# EAGLE design Sensor_Board (EAGLE 7.2.0)
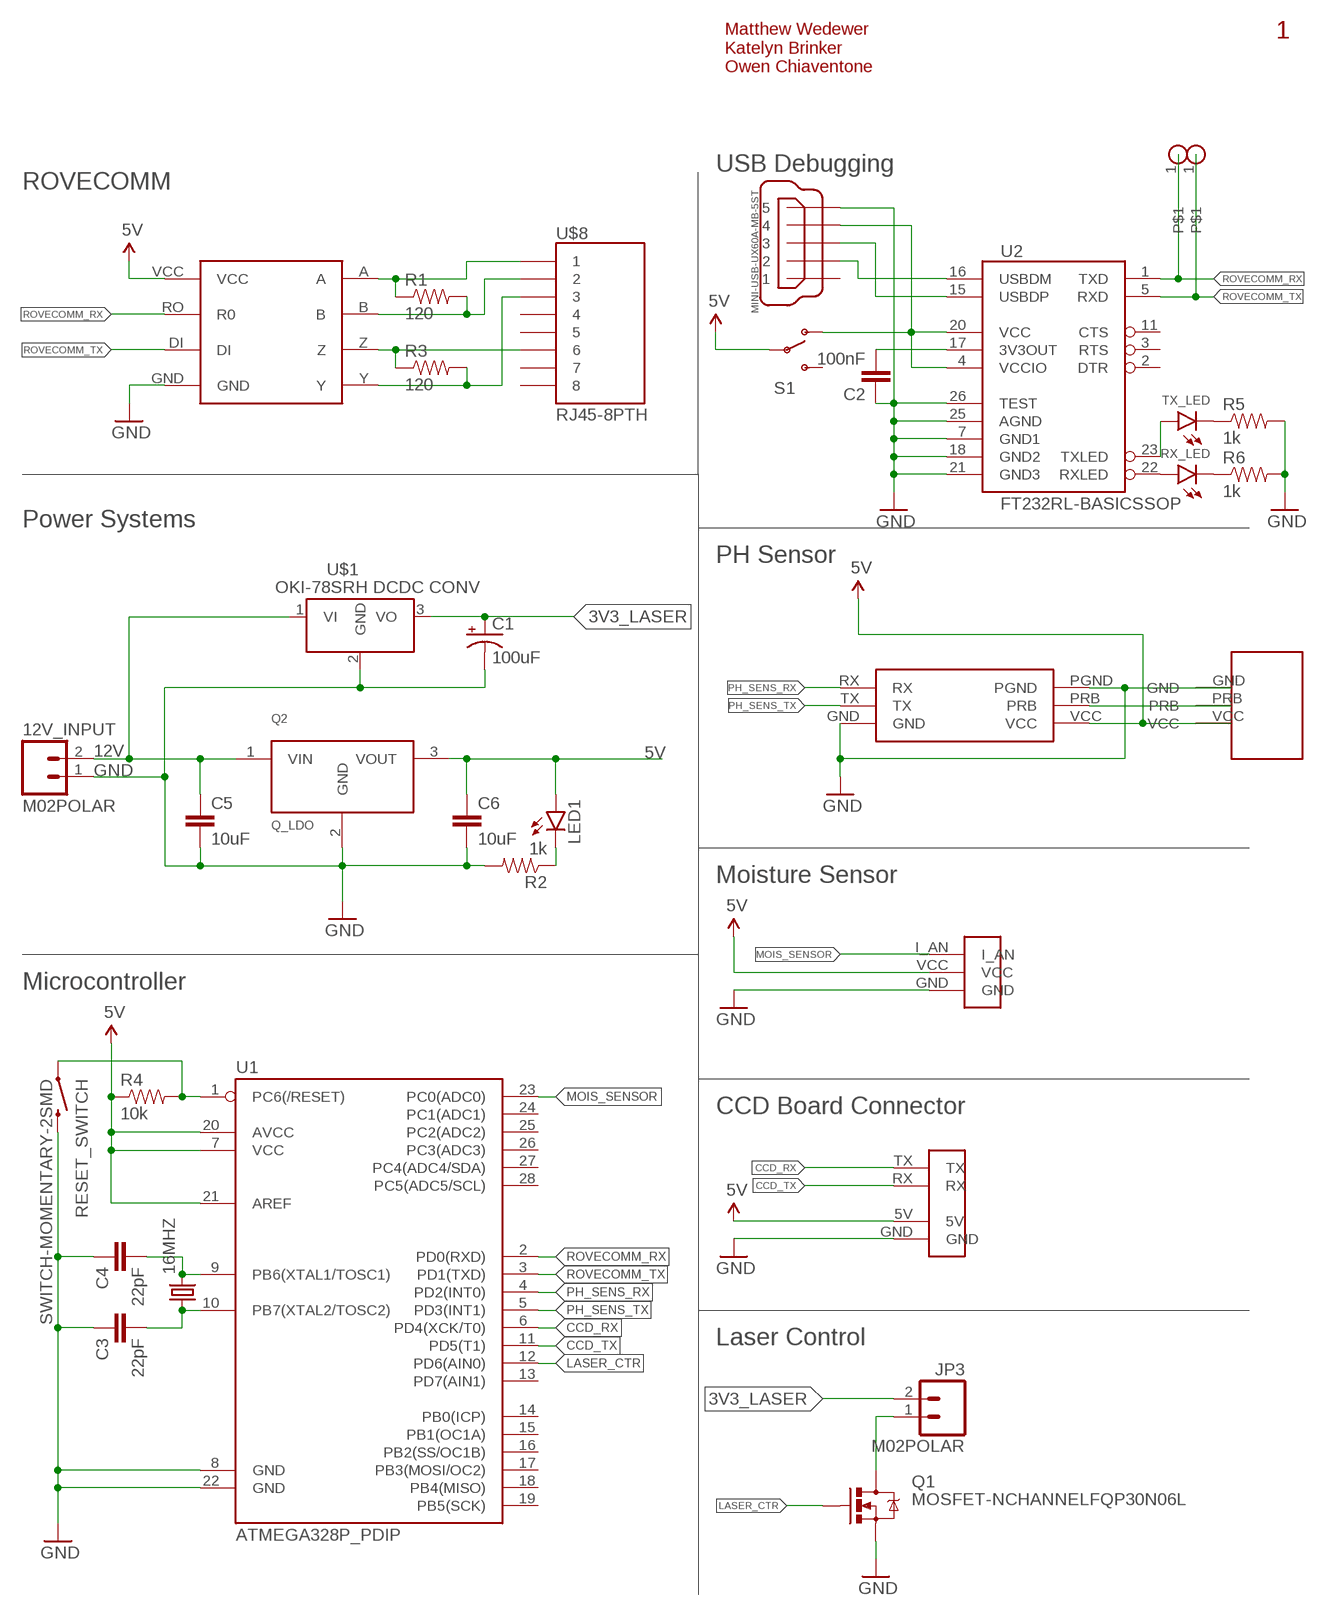
[diagram p0: schematic, sheet 1]

## Parts
12V_INPUT  M02POLAR  [MOLEX-1X2]
16MHZ  CRYSTALHC49US  [HC49US]
C1  100uF  CAP_POLPTH1  [CPOL-RADIAL-100UF-25V]
C2  100nF  CAP1206  [1206]
C3  22pF  CAP1206  [1206]
C4  22pF  CAP1206  [1206]
C5  10uF  CAP1206  [1206]
C6  10uF  CAP1206  [1206]
DEBUG_RX  J_HOLE  [J_AWG20]
DEBUG_TX  J_HOLE  [J_AWG20]
JP3  M02POLAR  [MOLEX-1X2]
LED1  LED1206  [LED-1206]
Q1  MOSFET-NCHANNELFQP30N06L  [TO220V]
Q2  Q_LDO  [TO-220]
R1  120  RESISTOR1206  [1206]
R2  1k  RESISTOR1206  [1206]
R3  120  RESISTOR1206  [1206]
R4  10k  RESISTOR1206  [1206]
R5  1k  RESISTOR1206  [1206]
R6  1k  RESISTOR1206  [1206]
RESET_SWITCH  SWITCH-MOMENTARY-2SMD  [TACTILE-SWITCH-SMD]
RX_LED  LED1206  [LED-1206]
S1  SWITCH-SPDTPTH  [SWITCH-SPDT]
TX_LED  LED1206  [LED-1206]
U1  ATMEGA328P_PDIP  [DIL28-3]
U2  FT232RL-BASICSSOP  [SSOP28DB]
U$1  Q_OKI-78SR  [OKI-78SRH]
U$3  PH_EZ0  [PH_EZ0]
U$4  PH_CONNECTOR  [PH_CONNECTOR]
U$5  MOISTURE_SENSOR  [MOISTURE_SENSOR]
U$6  CCD_CONNECTOR  [CCD_CONNECTOR]
U$7  MAX3077  [MAX3070E]
U$8  RJ45-8PTH  [RJ45-8]
X1  MINI-USB-UX60A-MB-5ST  [UX60A-MB-5ST]

## Nets
3V3_LASER: C1.1(+) JP3.2 U$1.3(VO)
5V: C6.1 LED1.A Q2.3(VOUT) R4.1 S1.2(P) U1.7(VCC) U1.20(AVCC) U1.21(AREF) U$3.VCC U$4.VCC U$5.VCC U$6.5V U$7.VCC
5V1: TX_LED.A U2.23(TXLED)
12V: 12V_INPUT.2 C5.1 Q2.1(VIN) U$1.1(VI)
CCD_RX: U1.6(PD4(XCK/T0)) U$6.TX
CCD_TX: U1.11(PD5(T1)) U$6.RX
GND: 12V_INPUT.1 C1.2(-) C2.1 C3.1 C4.1 C5.2 C6.2 Q1.3(S) Q2.2(GND) R2.2 R5.2 R6.2 RESET_SWITCH.3 U1.8(GND) U1.22(GND) U2.7(GND1) U2.18(GND2) U2.21(GND3) U2.25(AGND) U2.26(TEST) U$1.2(GND) U$3.GND U$3.PGND U$4.GND U$5.GND U$6.GND U$7.GND X1.5
LASER_CTR: Q1.1(G) U1.12(PD6(AIN0))
MOIS_SENSOR: U1.23(PC0(ADC0)) U$5.I_AN
N$1: JP3.1 Q1.2(D)
N$2: 16MHZ.2 C4.2 U1.9(PB6(XTAL1/TOSC1))
N$3: LED1.C R2.1
N$4: 16MHZ.1 C3.2 U1.10(PB7(XTAL2/TOSC2))
N$5: U$3.PRB U$4.PRB
N$6: R1.1 U$7.A U$8.1
N$7: R1.2 U$7.B U$8.2
N$8: R3.1 U$7.Z U$8.6
N$9: R3.2 U$7.Y U$8.3
N$10: R4.2 RESET_SWITCH.1 U1.1(PC6(/RESET))
N$11: C2.2 U2.17(3V3OUT)
N$12: U2.16(USBDM) X1.2
N$13: U2.15(USBDP) X1.3
N$14: S1.1(O) U2.4(VCCIO) U2.20(VCC) X1.4
N$15: R5.1 TX_LED.C
N$16: RX_LED.A U2.22(RXLED)
N$17: R6.1 RX_LED.C
PH_SENS_RX: U1.4(PD2(INT0)) U$3.RX
PH_SENS_TX: U1.5(PD3(INT1)) U$3.TX
ROVECOMM_RX: DEBUG_RX.1 U1.2(PD0(RXD)) U2.1(TXD) U$7.RO(R0)
ROVECOMM_TX: DEBUG_TX.1 U1.3(PD1(TXD)) U2.5(RXD) U$7.DI
Unconnected: S1.3(S) U1.13(PD7(AIN1)) U1.14(PB0(ICP)) U1.15(PB1(OC1A)) U1.16(PB2(SS/OC1B)) U1.17(PB3(MOSI/OC2)) U1.18(PB4(MISO)) U1.19(PB5(SCK)) U1.24(PC1(ADC1)) U1.25(PC2(ADC2)) U1.26(PC3(ADC3)) U1.27(PC4(ADC4/SDA)) U1.28(PC5(ADC5/SCL)) U2.2(DTR) U2.3(RTS) U2.11(CTS) U$8.4 U$8.5 U$8.7 U$8.8 X1.1

## Notes on the sheet
- 1
- Matthew Wedewer
  Katelyn Brinker
  Owen Chiaventone
- USB Debugging
- ROVECOMM
- Power Systems
- PH Sensor
- Moisture Sensor
- Microcontroller
- CCD Board Connector
- Laser Control

## Library data of the parts
12V_INPUT JP3 = SparkFun-Connectors:M02: Standard 2-pin 0.1" header. Use with - straight break away headers ( PRT-00116) - right angle break away headers (PRT-00553) - swiss pins (PRT-00743) - machine pins (PRT-00117) - female headers (PRT-00115) Molex polarized connector foot print use with: PRT-08233 with associated crimp pins and housings. 2.54_SCREWTERM for use with PRT-10571. 3.5mm Screw Terminal footprints for PRT-08084 5mm Screw Terminal footprints for use with PRT-08433
16MHZ = SparkFun-FreqCtrl:CRYSTAL: Various standard crystals. Proven footprints.
C1 = SparkFun-Capacitors:CAP_POL: Capacitor Polarized These are standard SMD and PTH capacitors. Normally 10uF, 47uF, and 100uF in electrolytic and tantalum varieties. Always verify the external diameter of the through hole cap, it varies with capacity, voltage, and manufacturer. The EIA devices should be standard.
C2-C4 = SparkFun-Passives:CAP: Capacitor Standard 0603 ceramic capacitor, and 0.1" leaded capacitor.
C5 C6 = SparkFun-Capacitors:CAP: Capacitor Standard 0603 ceramic capacitor, and 0.1" leaded capacitor.
DEBUG_RX DEBUG_TX = MRDT-2015-General:J_HOLE: Mounting hole for AWG #20
LED1 RX_LED TX_LED = SparkFun-LED:LED: LEDs Standard schematic elements and footprints for 5mm, 3mm, 1206, and 0603 sized LEDs. 5mm - Spark Fun Electronics SKU : COM-00529 (and others)
Q1 = SparkFun-DiscreteSemi:MOSFET-NCHANNEL: Common NMOSFET Parts MFG P/N Store ID Prod ID FDD8780 TRANS-09984 SI7820DN TRANS-11055 FDS6630A IC-08089 2N7002PW TRANS-11151 FQP30N06L COM-10213 TRANS-10060 BSS123LT1G TRANS-08345 BSS138 TRANS-00830 BS170 2N7000; PROD_ID: TRANS-10060
Q2 = MRDT-2015-General:Q_LDO: LDO with fixed ouput voltage
R1-R6 = SparkFun-Passives:RESISTOR: Resistor Basic schematic elements and footprints for 0603, 1206, and PTH resistors.
RESET_SWITCH = SparkFun-Electromechanical:SWITCH-MOMENTARY-2: Various NO switches- pushbuttons, reed, etc; PROD_ID: SWCH-08247
S1 = SparkFun-Electromechanical:SWITCH-SPDT: SPDT Switch Simple slide switch, Spark Fun Electronics SKU : COM-00102 DPDT SMT slide switch, AYZ0202, SWCH-08179
U1 = SparkFun-DigitalIC:ATMEGA328P_PDIP: uC used in the Arduino 32kb flash, 1k EEPROM, 2k SRAM This is the through-hole version of this chip.
U2 = SparkFun-DigitalIC:FT232RL-BASIC: USB UART This is the simplified version of the FT232RL unit. Only what you need, nothing you don't. Spark Fun Electronics SKU : COM-00650
U$1 = MRDT-2015-PowerBoard:Q_OKI-78SR: 4.95W DC/DC Converter Manufacturer: Murata Part Number: OKI-78SR-5/1.5-W36H-C OKI-78SR-3.3/1.5-W36H-C
U$3 = pH_EZ0:PH_EZ0
U$4 = PH_CONNECTOR:PH_CONNECTOR
U$5 = moisture sensor:MOISTURE_SENSOR
U$6 = CCD_CONNECTOR:CCD_CONNECTOR
U$7 = MAX3077:MAX3077
U$8 = SparkFun-Connectors:RJ45-8: RJ45 Jack Simple RJ45, 8-pin connection - connector for common Cat5, Cat5e, and Cat6 Ethernet cables. Footprint not yet proven in production. Connector sku is PRT-00643; Breakout PCB sku is BOB-00716.
X1 = con-hirose:MINI-USB-: MINI USB Connector Source: http://www.hirose.co.jp/cataloge_hp/e24000019.pdf; OC_FARNELL: unknown; OC_NEWARK: unknown

## Board
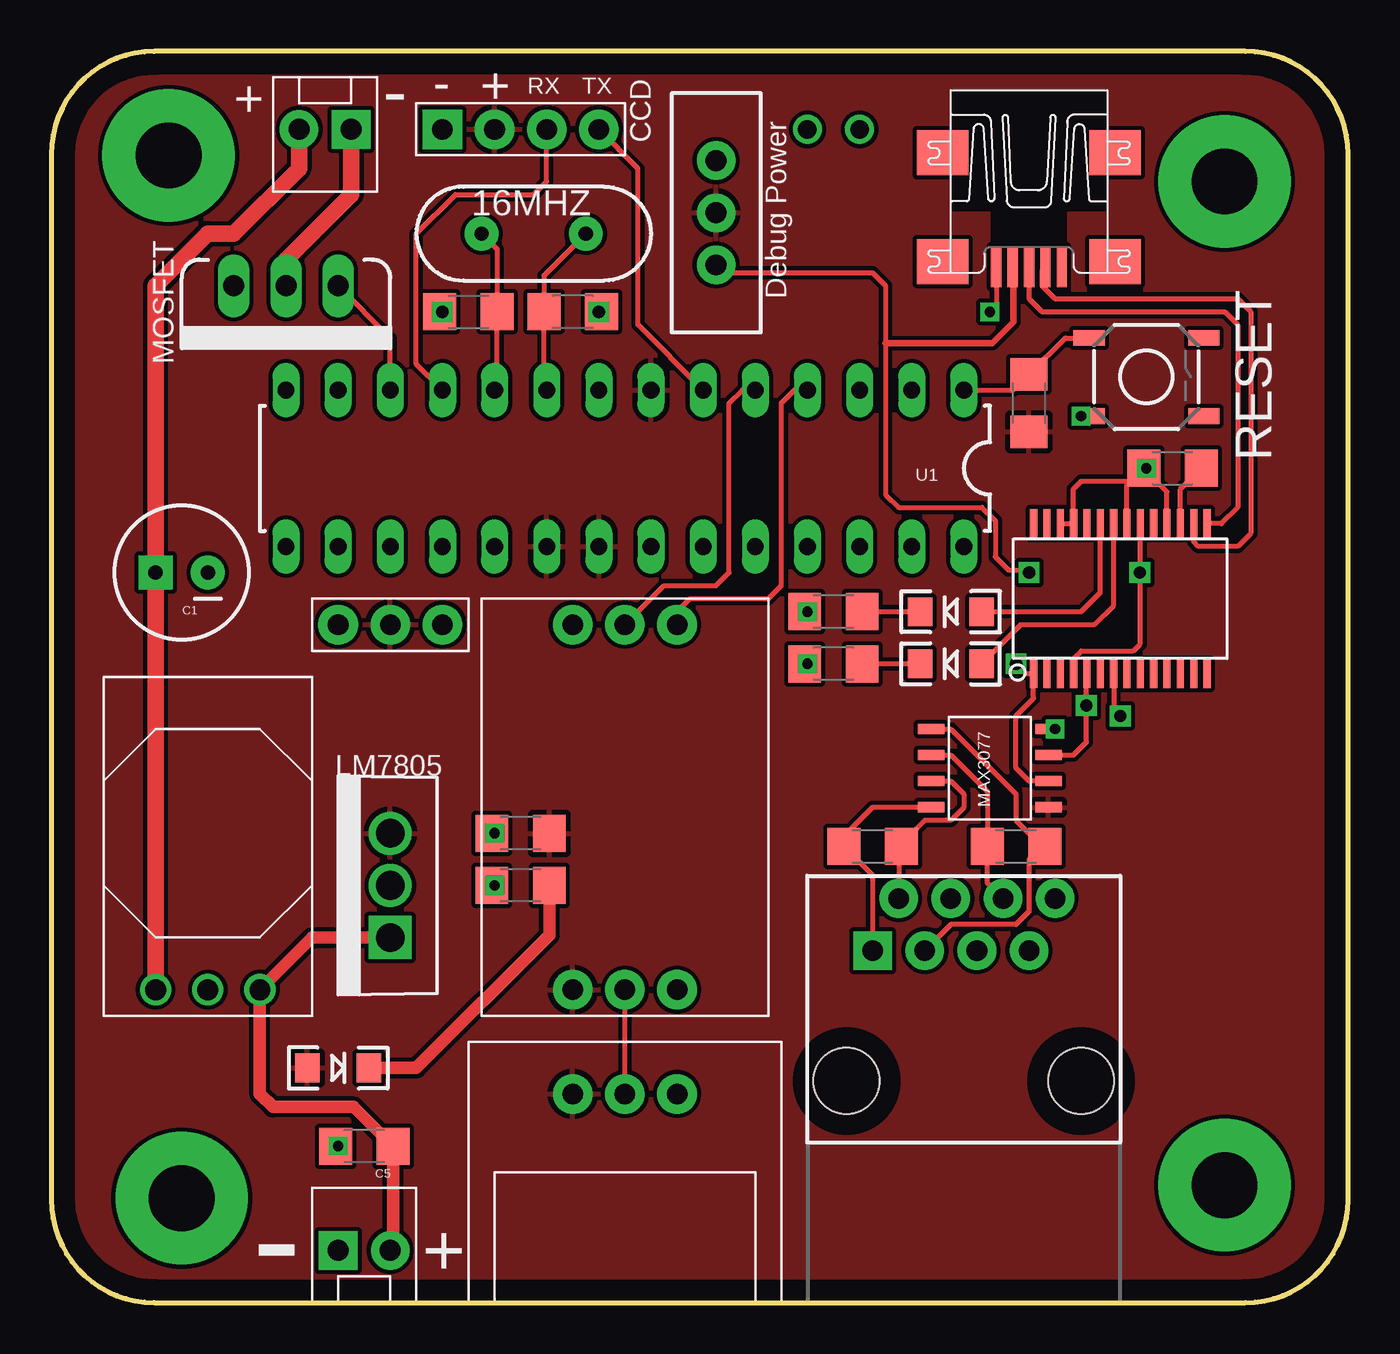
[diagram p1: board, top side]
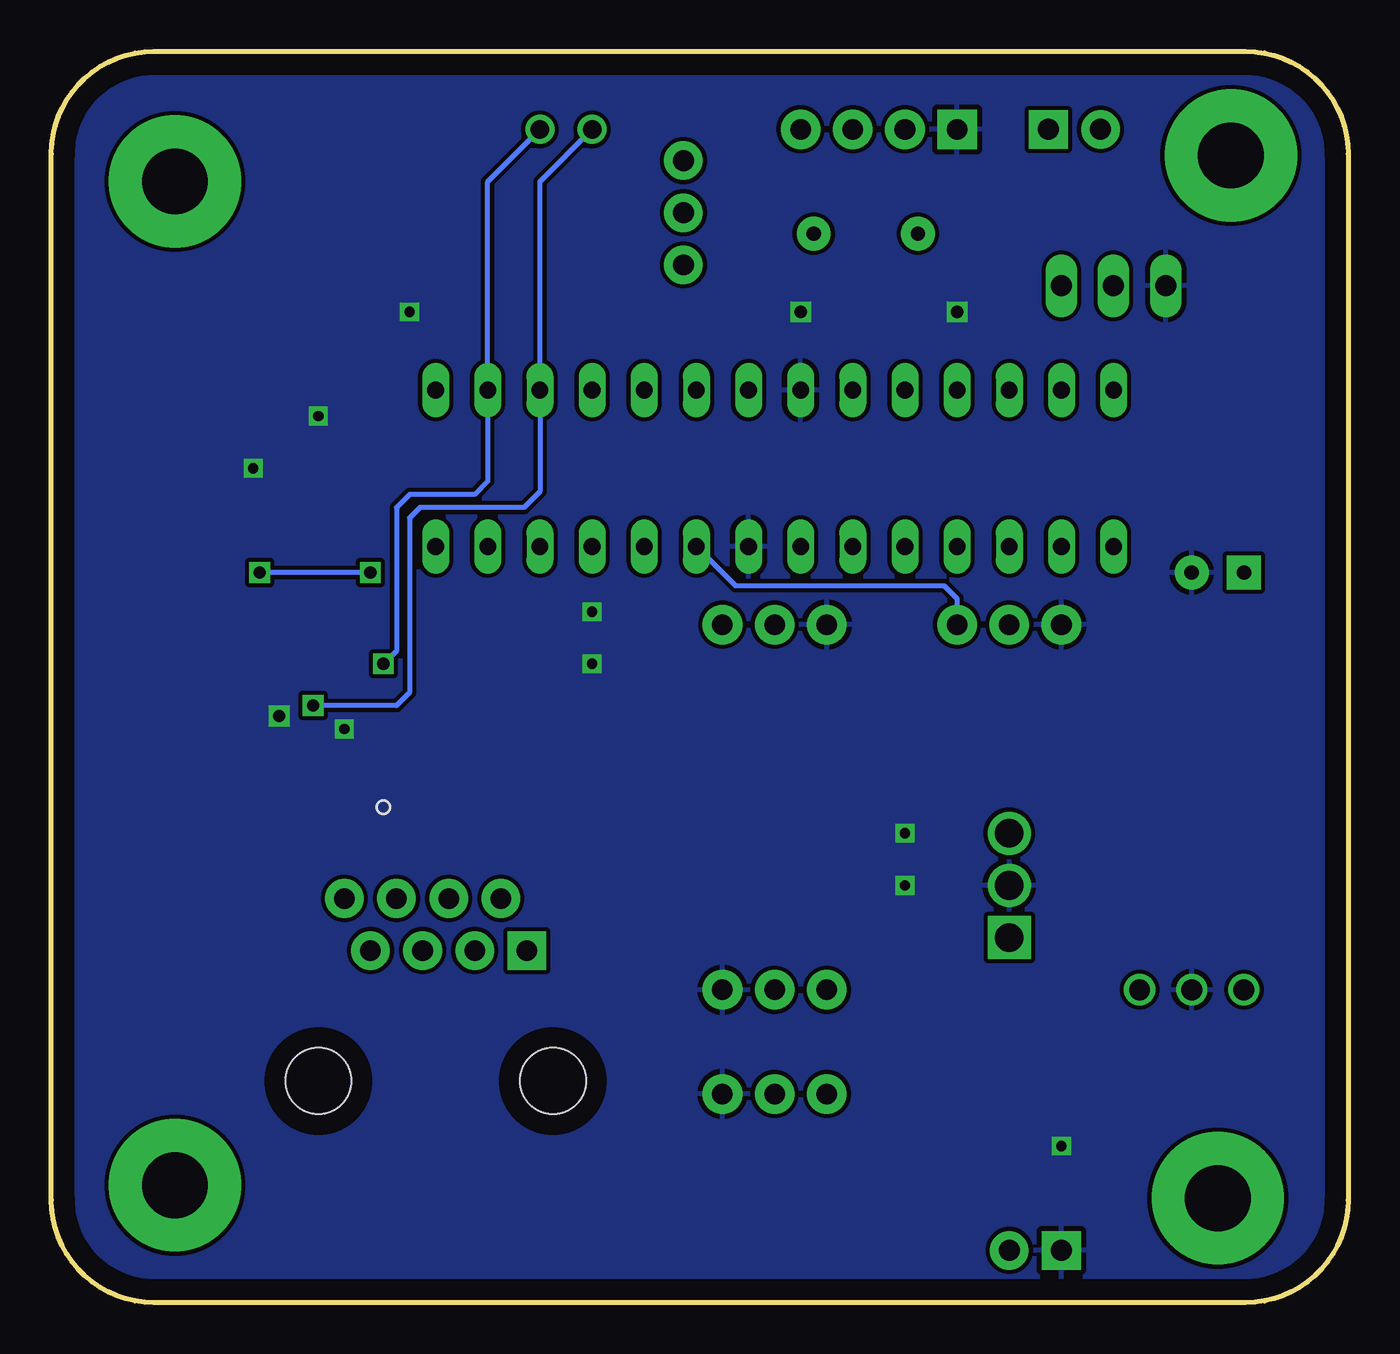
[diagram p2: board, bottom side, seen from below]

Size 63.17 x 60.95 mm. Coordinates in mm from the lower left corner, seen from the top.
Outline: 0,55.95 0,5 arc90 5,0 58.17,0 arc90 63.17,5 63.17,55.95 arc90 58.17,60.95 5,60.95 arc90 0,55.95
Copper layers (1*16): Top 0.035mm / dielectric 1.5mm / Bottom 0.035mm
Design rules "default": minimum track width 10mil, minimum drill 24mil, track to track 8mil, track to pad 8mil, pad to pad 8mil, via to via 8mil, smd to smd 8mil, copper to edge 40mil, drill to drill 8mil, minimum pad ring 10mil, minimum via ring 8mil, stop-mask expansion 4mil, vias tented up to drill 0mil, thermal gap 10mil

### Footprints (pad centres in the part's own frame; a part is rotated, then mirrored left to right if it is on the bottom)
MOLEX-1X2 = drill 1.016 pad 1.88 square: 1 0,0 | drill 1.016 pad 1.88: 2 2.54,0
HC49US = drill 0.7 pad 1.651: 1 -2.54,0; 2 2.54,0
CPOL-RADIAL-100UF-25V = drill 0.7 pad 1.651 square: 1 1.27,0 | drill 0.7 pad 1.651: 2 -1.27,0
1206 = smd 1.6 x 1.8: 1 -1.4,0; 2 1.4,0
J_AWG20 = drill 0.9: 1 0,0
LED-1206 = smd 1.2 x 1.4: A -1.5,0; C 1.5,0
TO220V = drill 1.016 long: 1 -2.54,0; 2 0,0; 3 2.54,0
TO-220 = drill 1.397 square: 1 -2.54,0 | drill 1.397: 2 0,0; 3 2.54,0
TACTILE-SWITCH-SMD = smd 1.524 x 0.762: 1 -2.794,1.905; 2 2.794,1.905; 3 -2.794,-1.905; 4 2.794,-1.905
SWITCH-SPDT = drill 1.016 pad 1.88: 1 0,2.54; 2 0,0; 3 0,-2.54
DIL28-3 = drill 0.813 long: 1 -16.51,-3.81; 2 -13.97,-3.81; 3 -11.43,-3.81; 4 -8.89,-3.81; 5 -6.35,-3.81; 6 -3.81,-3.81; 7 -1.27,-3.81; 8 1.27,-3.81; 9 3.81,-3.81; 10 6.35,-3.81; 11 8.89,-3.81; 12 11.43,-3.81; 13 13.97,-3.81; 14 16.51,-3.81; 15 16.51,3.81; 16 13.97,3.81; 17 11.43,3.81; 18 8.89,3.81; 19 6.35,3.81; 20 3.81,3.81; 21 1.27,3.81; 22 -1.27,3.81; 23 -3.81,3.81; 24 -6.35,3.81; 25 -8.89,3.81; 26 -11.43,3.81; 27 -13.97,3.81; 28 -16.51,3.81
SSOP28DB = smd 0.348 x 1.397: 1 -4.225,-3.656; 2 -3.575,-3.656; 3 -2.925,-3.656; 4 -2.275,-3.656; 5 -1.625,-3.656; 6 -0.975,-3.656; 7 -0.325,-3.656; 8 0.325,-3.656; 9 0.975,-3.656; 10 1.625,-3.656; 11 2.275,-3.656; 12 2.925,-3.656; 13 3.575,-3.656; 14 4.225,-3.656; 15 4.225,3.656; 16 3.575,3.656; 17 2.925,3.656; 18 2.275,3.656; 19 1.625,3.656; 20 0.975,3.656; 21 0.325,3.656; 22 -0.325,3.656; 23 -0.975,3.656; 24 -1.625,3.656; 25 -2.275,3.656; 26 -2.925,3.656; 27 -3.575,3.656; 28 -4.225,3.656
OKI-78SRH = drill 1.016: 1 2.54,0; 2 0,0; 3 -2.54,0
PH_EZ0 = drill 1 pad 1.93: GND 4.445,19.05; PGND 9.525,1.27; PRB 6.985,1.27; RX 9.525,19.05; TX 6.985,19.05; VCC 4.445,1.27
PH_CONNECTOR = drill 1 pad 1.93: GND 2.54,2.54; PRB 0,2.54; VCC -2.54,2.54
MOISTURE_SENSOR = drill 1 pad 1.93: GND -2.54,0; I_AN 2.54,0; VCC 0,0
CCD_CONNECTOR = drill 1 pad 1.93: 5V 1.27,0; RX -1.27,0; TX -3.81,0 | drill 1 pad 1.93 square: GND 3.81,0
MAX3070E = smd 0.49 x 1.3: A -1.905,2.857; B -0.635,2.857; DI 0.635,-2.857; GND 1.905,-2.857; RO -0.635,-2.857; VCC -1.905,-2.857; Y 1.905,2.857; Z 0.635,2.857
RJ45-8 = drill 1 pad 1.88 square: 1 -4.445,6.35 | drill 1 pad 1.88: 2 -3.175,8.89; 3 -1.905,6.35; 4 -0.635,8.89; 5 0.635,6.35; 6 1.905,8.89; 7 3.175,6.35; 8 4.445,8.89 | hole 3.2: -5.715,0; 5.715,0
UX60A-MB-5ST = smd 2 x 0.5: 1 2.25,1.6; 2 2.25,0.8; 3 2.25,0; 4 2.25,-0.8; 5 2.25,-1.6 | smd 2.2 x 2.5: M1 -3.3,-4.2; M2 -3.3,4.2; M3 2,4.2; M4 2,-4.2

### Placement (x,y rotation side)
12V_INPUT  13.97,2.54 0 top
16MHZ  23.5,52.07 0 top
C1  6.35,35.56 180 top
C2  54.61,40.64 0 top
C3  20.32,48.26 0 top
C4  25.4,48.26 180 top
C5  15.24,7.62 180 top
C6  22.86,22.86 180 top
DEBUG_RX  39.37,57.15 270 top
DEBUG_TX  36.83,57.15 270 top
JP3  14.61,57.15 180 top
LED1  13.97,11.43 0 top
Q1  11.43,49.53 180 top
Q2  16.51,20.32 90 top
R1  40.01,22.23 0 top
R2  22.86,20.32 180 top
R3  46.99,22.23 0 top
R4  47.62,43.81 90 top
R5  38.1,33.66 180 top
R6  38.1,31.11 180 top
RESET_SWITCH  53.34,45.09 0 top
RX_LED  43.81,31.11 180 top
S1  32.38,53.09 180 top
TX_LED  43.81,33.66 180 top
U1  27.94,40.64 180 top
U2  52.07,34.29 0 top
U$1  7.62,15.24 0 top
U$3  20.95,13.97 0 top
U$4  27.94,7.62 0 top
U$5  16.51,33.02 0 top
U$6  22.86,57.15 180 top
U$7  45.72,26.04 90 top
U$8  44.45,10.79 0 top
X1  47.62,52.7 270 top

### Tracks (layer width: path | path; a pad name or v marks a point on that pad's centre or on a via)
3V3_LASER
  Top 0.813: U$1.3 C1.1 5.08,49.53 7.62,52.07 8.89,52.07 12.06,55.24 JP3.2
5V
  pour Top: -1.27,62.23 63.5,62.23 63.5,-1.27 -1.27,-1.27
5V1
  Top 0.254: TX_LED.A 50.16,33.66 51.09,34.59 U2.23
12V
  Top 0.61: 12V_INPUT.2 16.64,2.67 C5.1 14.73,9.53 10.79,9.53 10.16,10.16 U$1.1 12.7,17.78 Q2.1
CCD_RX
  Top 0.254: U1.6 28.57,47.62 28.57,55.24 U$6.TX
CCD_TX
  Top 0.254: U1.11 17.78,45.72 17.78,52.07 19.68,53.98 23.5,53.98 24.13,54.61 U$6.RX
GND  (via drill 0.5 pad 0.41, 0.6 pad 0.41)
  Top 0.254: R6.2 v36.83,31.11 | U$7.GND v48.9,27.94 | R5.2 v36.83,33.66 | U2.21 52.4,39.83 C2.1 | C2.1 54.34,39.51 U2.18 | U2.26 U2.25 49.8,39.63 50.16,40.01 52.58,40.01 | 52.58,40.01 C2.1 | 52.58,40.01 52.7,40.01 v53.34,40.64 | RESET_SWITCH.3 v50.16,43.18 | X1.5 46.02,48.56 v45.72,48.26 | R2.2 v21.59,20.32 | C6.2 v21.59,22.86 | C5.2 v13.97,7.62 | U2.7 51.74,28.9 v52.07,28.57 | C4.1 v26.67,48.26 | C3.1 v19.05,48.26
  pour Bottom: -2.54,63.5 64.77,63.5 64.77,-3.81 -2.54,-3.81
LASER_CTR
  Top 0.254: U1.12 16.51,46.99 Q1.1
MOIS_SENSOR
  Bottom 0.254: U1.23 29.84,34.92 19.68,34.92 19.05,34.29 U$5.I_AN
N$1
  Top 0.813: JP3.1 14.61,53.98 11.43,50.8 Q1.2
N$2
  Top 0.254: U1.9 24,44.58 C4.2 24,50.03 16MHZ.2
N$3
  Top 0.61: LED1.C 17.78,11.43 24.26,17.91 R2.1
N$4
  Top 0.254: U1.10 21.72,44.58 C3.2 21.72,51.3 16MHZ.1
N$5
  Top 0.254: U$4.PRB U$3.PRB
N$6
  Top 0.254: U$7.A 40.01,24.13 38.6,22.73 R1.1 40.01,20.82 U$8.1
N$7
  Top 0.254: U$7.B 43.81,25.4 44.45,24.77 44.45,24.13 43.81,23.5 42.55,23.5 41.41,22.36 R1.2 41.27,22.09 U$8.2
N$8
  Top 0.254: U$7.Z 43.81,26.67 45.59,24.89 R3.1 45.59,20.45 U$8.6
N$9
  Top 0.254: U$7.Y 43.81,27.94 46.99,24.77 46.99,23.5 48.26,22.23 | 48.26,22.23 R3.2 | 48.26,22.23 47.62,21.59 47.62,19.05 46.99,18.41 43.81,18.41 U$8.3
N$10
  Top 0.254: U1.1 46.86,44.45 R4.2 49.4,46.99 RESET_SWITCH.1
N$11
  Top 0.254: U2.17 54.99,39.62 C2.2
N$12
  Top 0.254: X1.2 48.26,50.29 48.26,49.53 48.9,48.9 57.78,48.9 58.42,48.26 58.42,37.47 57.78,36.83 55.88,36.83 55.65,37.06 U2.16
N$13
  Top 0.254: X1.3 47.62,48.9 48.26,48.26 57.15,48.26 57.78,47.62 57.78,38.73 57,37.95 U2.15
N$14  (via drill 0.6 pad 0.41)
  Top 0.254: U2.4 49.8,31.38 50.16,31.75 52.7,31.75 53.05,32.09 53.05,35.56 | 53.05,35.56 U2.20 | v53.02,35.56 53.05,35.56 | v47.62,35.56 47.5,35.69 46.61,35.69 45.97,36.32 45.97,38.1 45.34,38.73 41.27,38.73 40.64,39.37 40.64,46.74 40.64,49.53 40.01,50.16 32.77,50.16 S1.1
  Top 0.305: X1.4 46.86,50.42 46.86,47.75 45.85,46.74 40.64,46.74
  Bottom 0.254: v47.62,35.56 v53.02,35.56
N$15
  Top 0.254: R5.1 TX_LED.C
N$16
  Top 0.254: RX_LED.A 47.22,33.02 50.8,33.02 51.74,33.97 U2.22
N$17
  Top 0.254: RX_LED.C R6.1
N$18  (via drill 3.2 pad 6.45)
  other vias: 6.35,5.08
N$19  (via drill 3.2 pad 6.45)
  other vias: 5.71,55.88
N$20  (via drill 3.2 pad 6.45)
  other vias: 57.15,54.61
N$21  (via drill 3.2 pad 6.45)
  other vias: 57.15,5.71
PH_SENS_RX
  Top 0.254: U$3.RX 30.48,33.66 31.11,34.29 34.92,34.29 35.56,34.92 35.56,43.81 36.2,44.45 U1.4
PH_SENS_TX
  Top 0.254: U$3.TX 29.84,34.92 32.38,34.92 33.02,35.56 33.02,43.81 33.66,44.45 U1.5
ROVECOMM_RX  (via drill 0.6 pad 0.41)
  Top 0.254: U$7.RO 47.62,25.4 46.99,26.04 46.99,28.57 47.84,29.43 U2.1 47.47,30.63 v46.99,31.11
  Bottom 0.254: DEBUG_RX.1 41.91,54.61 U1.2 41.91,40.01 42.55,39.37 45.72,39.37 46.35,38.73 46.35,31.75 v46.99,31.11
ROVECOMM_TX  (via drill 0.6)
  Top 0.254: U$7.DI 49.78,26.67 50.42,27.3 v50.42,29.08 50.42,29.59 50.42,30.61 U2.5
  Bottom 0.254: DEBUG_TX.1 39.37,54.61 U1.3 39.37,39.5 40.13,38.73 45.21,38.73 45.72,38.23 45.72,29.72 46.35,29.08 v50.42,29.08

### Text on the board
tDocu: TX | RX | Debug | LASER | FT232RL | TX | O | - | S | RX | Moisture | + | O | G | I | BOARD POWER | Science Board | Missouri S&T Mars Rover Design Team | 12V
tSilk: - | + | RX | TX | + | - | CCD | Debug Power | MOSFET | RESET | LM7805 | + | -